# EasyEDA schematic Schematic.json
TITLE: Sheet_1; REV: 1.0; Date: 2024-05-21; Sheet: 1/1; Drawn By: anayal8er; Company: Your Company
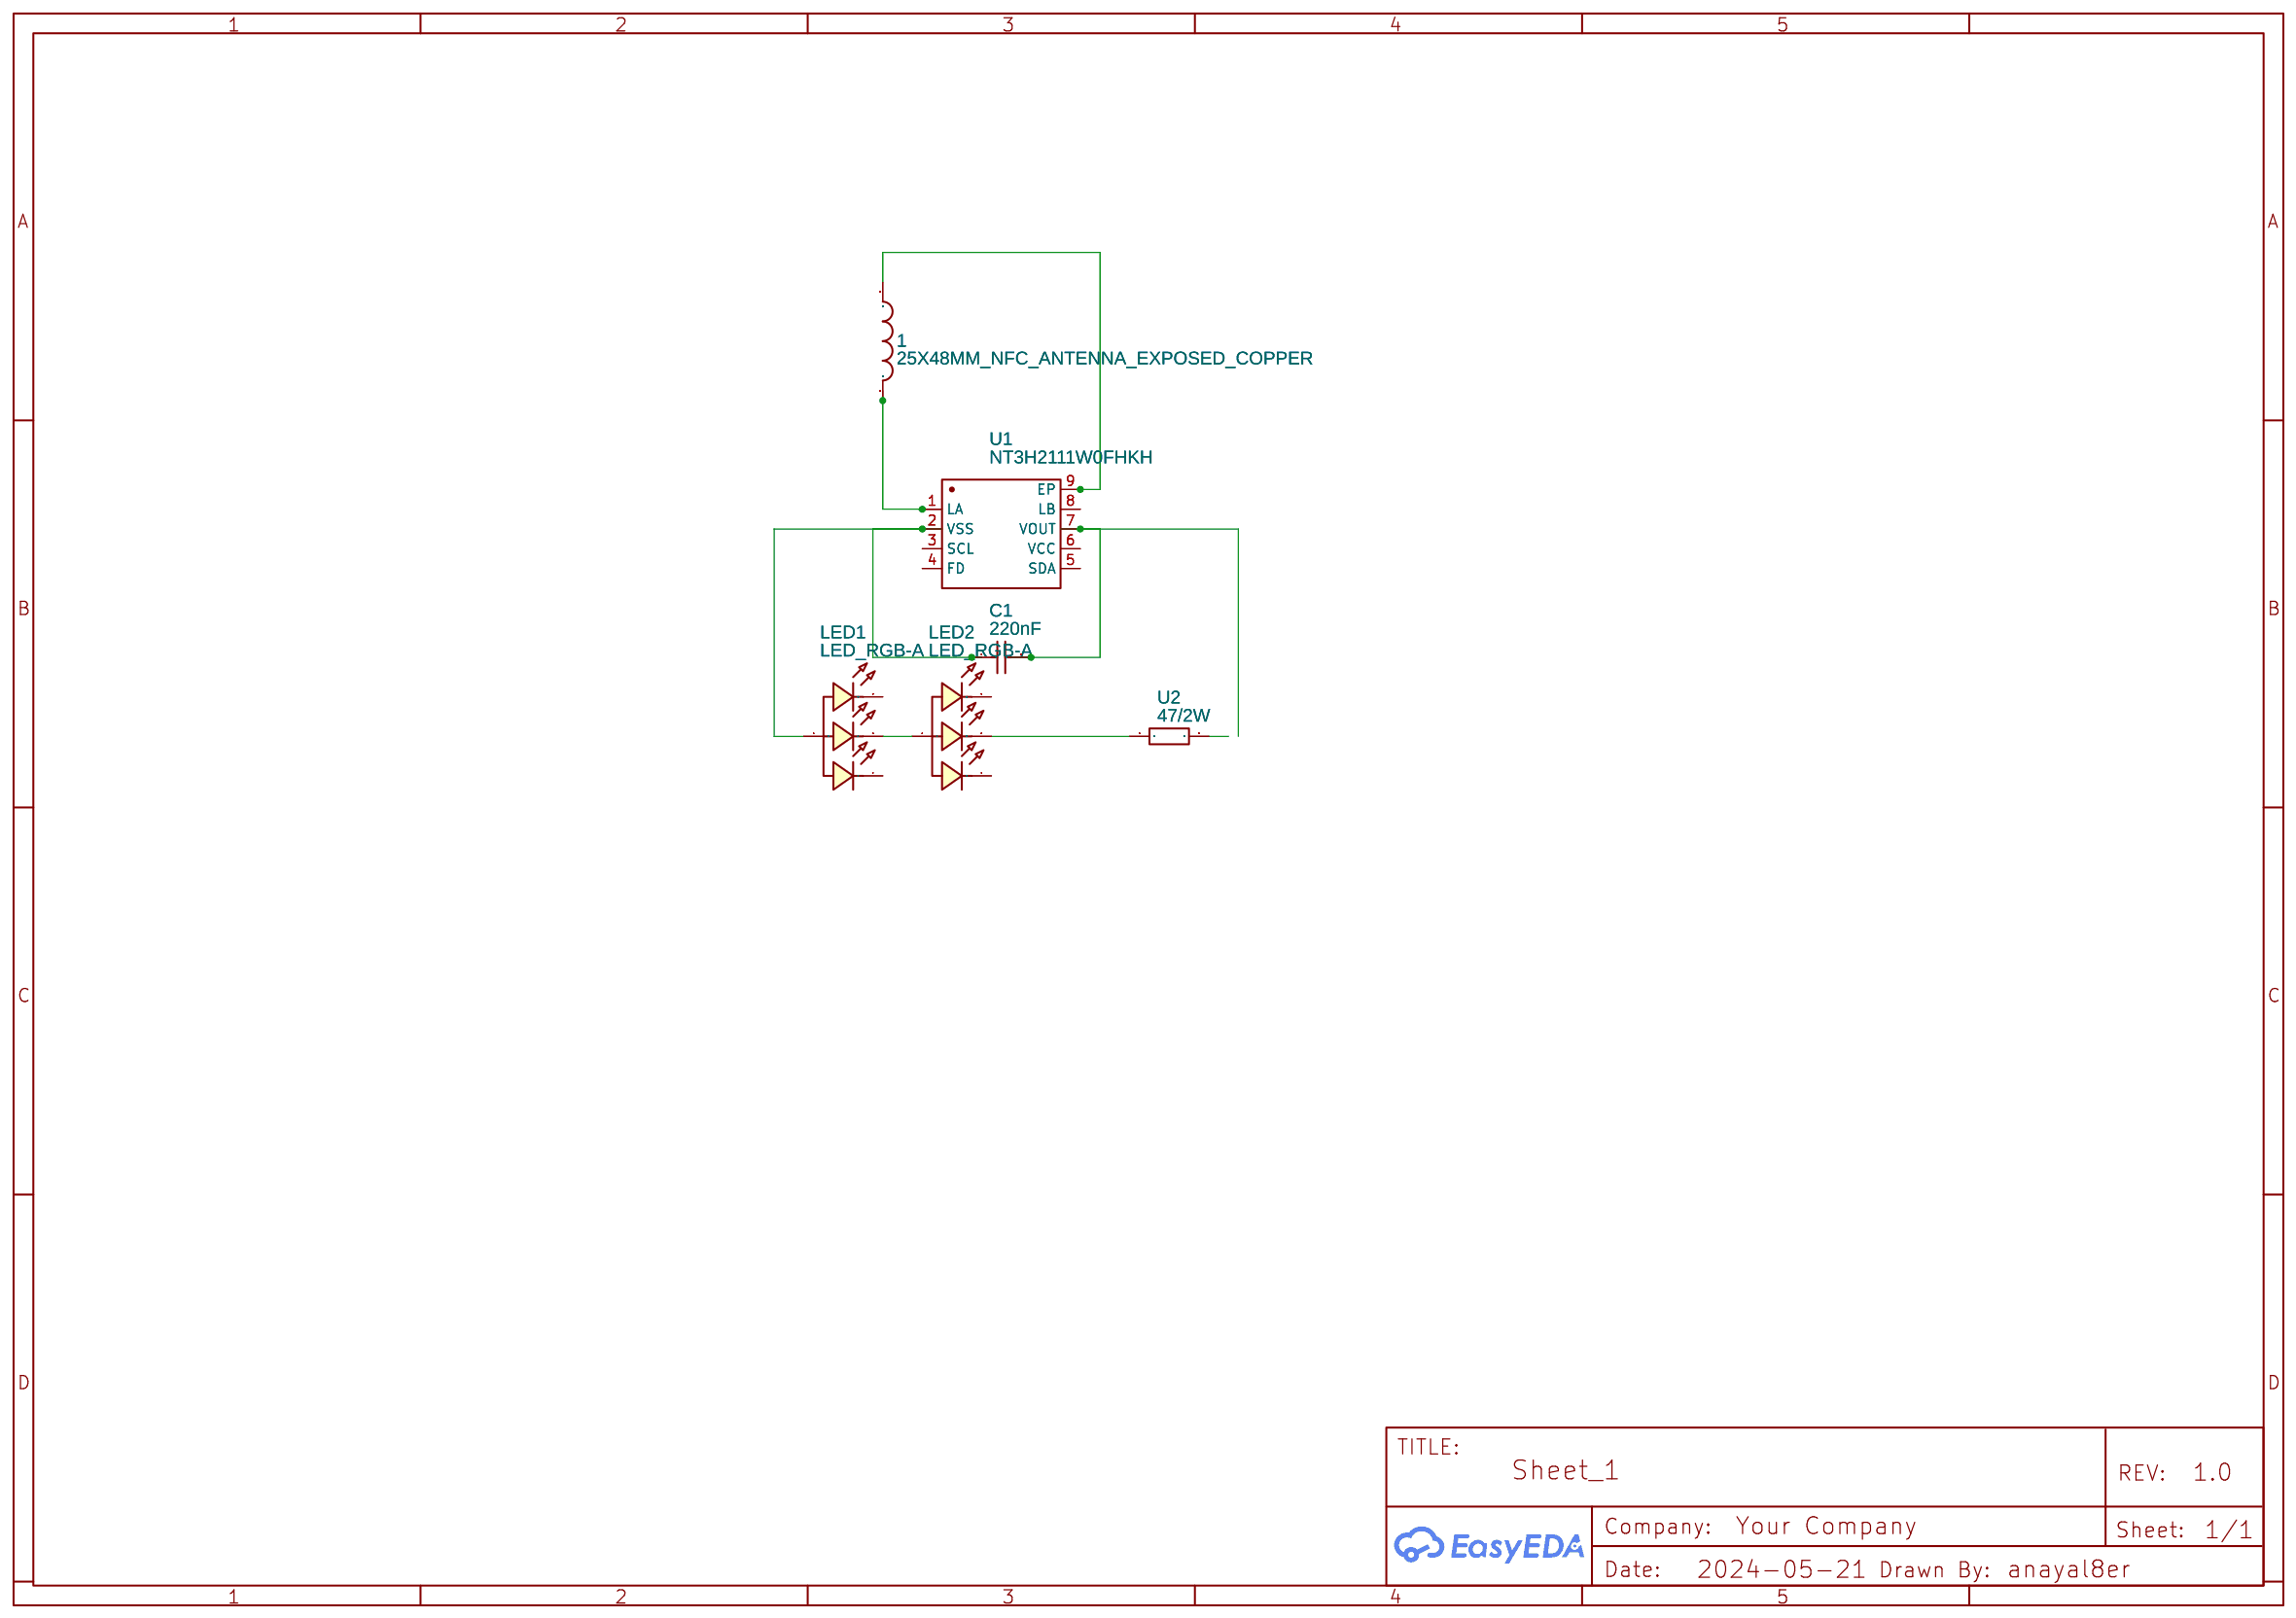
[diagram p0: schematic sheet]

## Parts
1  25X48MM_NFC_ANTENNA_EXPOSED_COPPER  [25X48MM_NFC_ANTENNA]
C1  220nF  [C0805]
LED1  LED_RGB-A  [LED-SMD_4P-L3.2-W1.5_LED_RGB-A]
LED2  LED_RGB-A  [LED-SMD_4P-L3.2-W1.5_LED_RGB-A]
U1  NT3H2111W0FHKH  [XQFN-8_L1.6-W1.6-P0.50-BL]
U2  47/2W  [RES-TH_BD5.0-L15.5-P20.00-D0.7]

## Library data of the parts
1 = 25X48MM_NFC_ANTENNA_EXPOSED_COPPER: Contributor: bekirdurmaz2012
C1 = CL21B224KBFNNNE: Supplier: LCSC; Manufacturer: SAMSUNG(三星); Supplier Part: C5378; JLCPCB Part Class: Basic Part
LED1 LED2 = LED_RGB-A: Contributor: LCSC; Supplier: LCSC; Supplier Part: C9900002410; Manufacturer Part: LED_RGB红蓝双色; Manufacturer: null
U1 = NT3H2111W0FHKH: Contributor: LCSC; Supplier: LCSC; Supplier Part: C710403; Manufacturer: NXP(恩智浦); JLCPCB Part Class: Extended Part
U2 = 47/2W: Contributor: LCSC; Supplier: LCSC; Supplier Part: C9900002227; Manufacturer: null; JLCPCB Part Class: Extended Part

## Nets
Net-(1-P$1): 1.P$1 U1.9(EP)
Net-(1-P$2): 1.P$2 U1.1(LA)
Net-(C1-1): C1.1 LED1.1 U1.2(VSS)
Net-(C1-2): C1.2 U1.7(VOUT)
Net-(LED1-2): LED1.2 LED2.1
Net-(LED2-2): LED2.2 U2.1

Not connected (* = marked no-connect by the designer): LED1 3 4; LED2 3 4; U1 3(SCL) 4(FD) 5(SDA) 6(VCC) 8(LB); U2 2
